# EAGLE design FullPrototypingBoard (EAGLE 7.5.0)
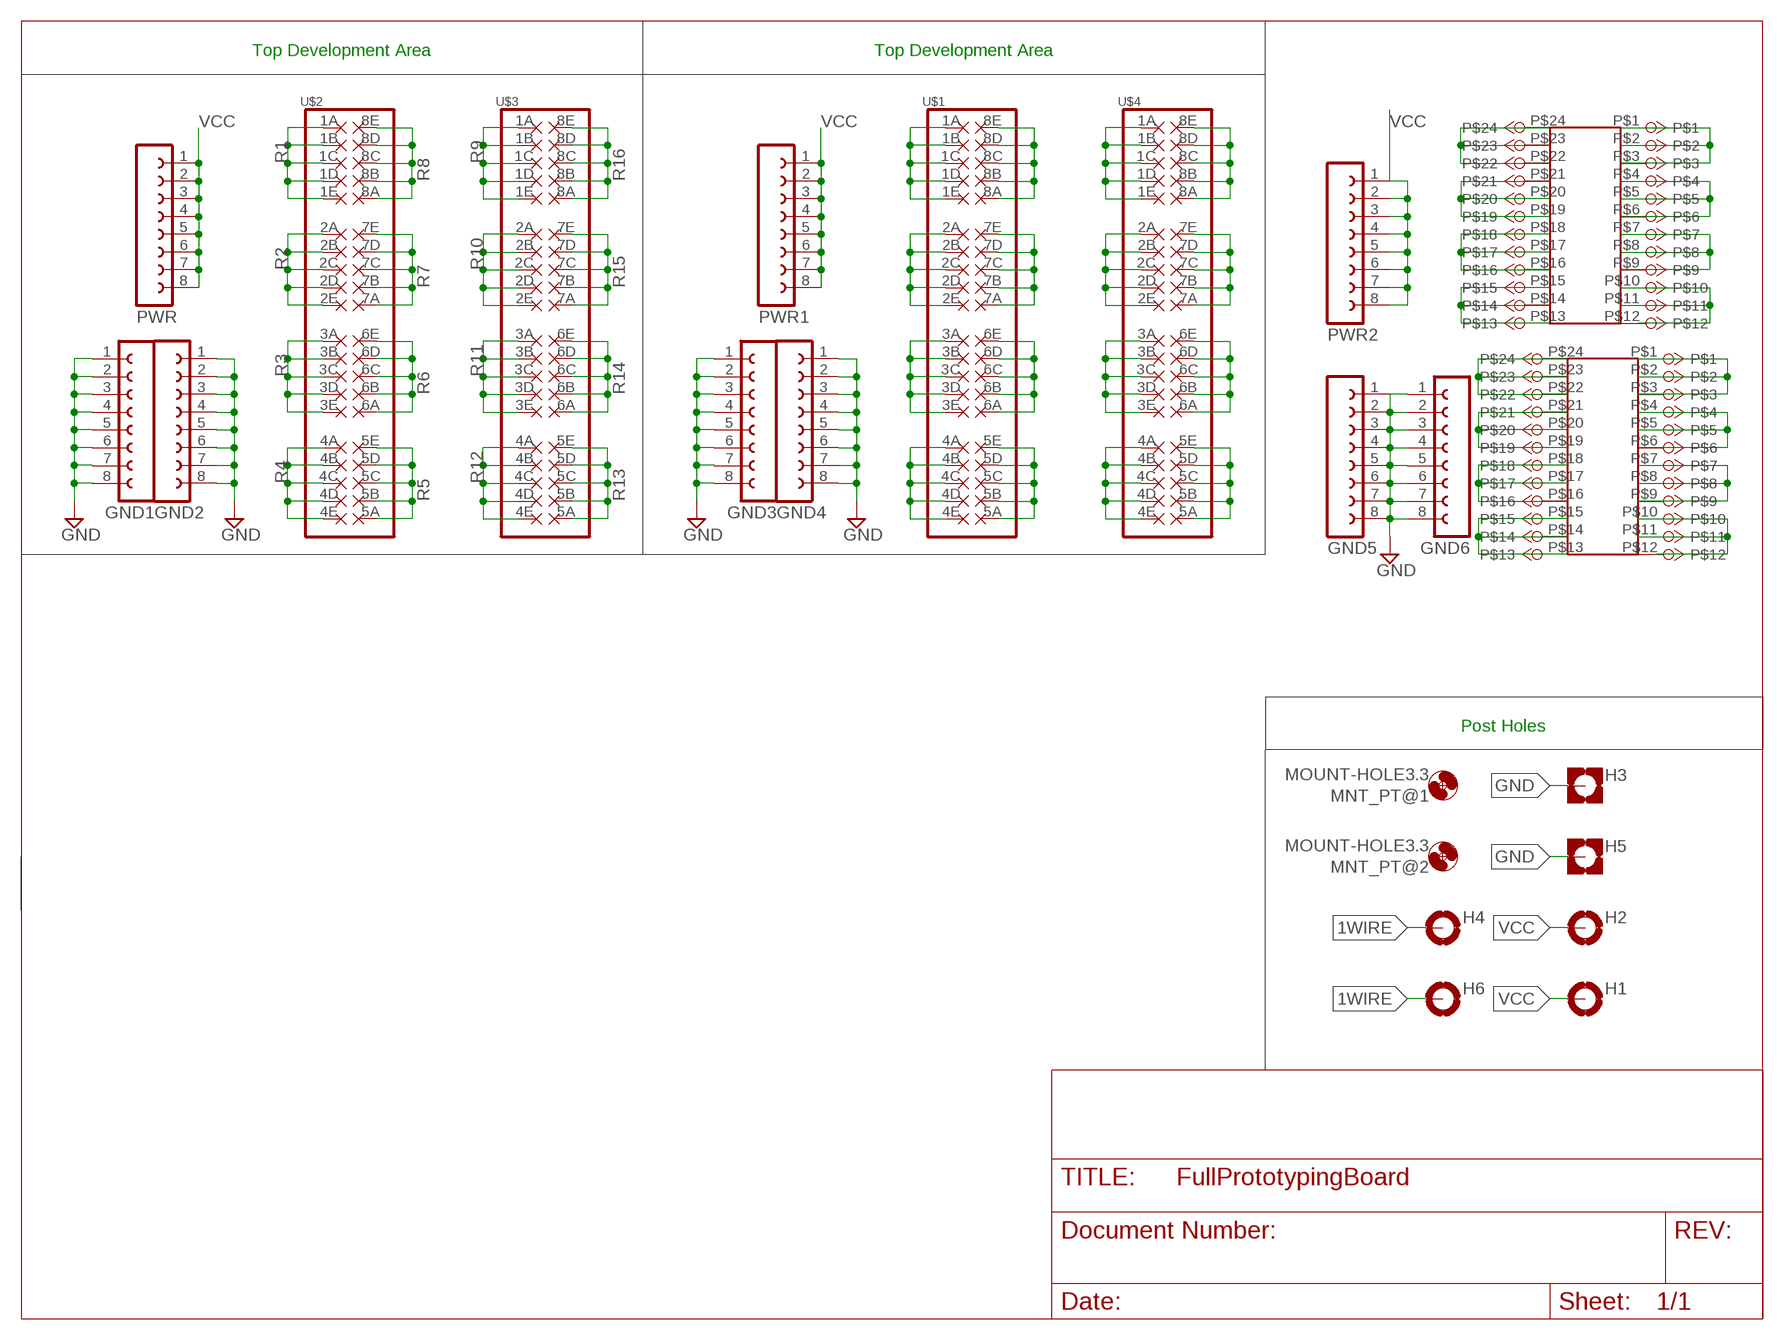
[diagram p0: schematic, sheet 1]

## Parts
GND1  FE08-1-GND  [FE08-GND]
GND2  FE08-1-GND  [FE08-GND]
GND3  FE08-1-GND  [FE08-GND]
GND4  FE08-1-GND  [FE08-GND]
GND5  FE08-1-GND  [FE08-GND]
GND6  FE08-1-GND  [FE08-GND]
H1  MOUNT-PAD-ROUND3.3  [3,3-PAD]
H2  MOUNT-PAD-ROUND3.3  [3,3-PAD]
H3  MOUNT-PAD-SQUARE3.3  [3,3-PAD-SQUARE]
H4  MOUNT-PAD-ROUND3.3  [3,3-PAD]
H5  MOUNT-PAD-SQUARE3.3  [3,3-PAD-SQUARE]
H6  MOUNT-PAD-ROUND3.3  [3,3-PAD]
MNT_PT@1  MOUNT-HOLE3.3  [3,3]
MNT_PT@2  MOUNT-HOLE3.3  [3,3]
PWR  FE08-1  [FE08]
PWR1  FE08-1  [FE08]
PWR2  FE08-1  [FE08]
U$1  PROTO-5X8  [PROTO-5X08]
U$2  PROTO-5X8  [PROTO-5X08]
U$3  PROTO-5X8  [PROTO-5X08]
U$4  PROTO-5X8  [PROTO-5X08]
U$5  PROTO-3X8  [PROTO-3X08]
U$6  PROTO-3X8  [PROTO-3X08]

## Nets
1WIRE: H4.B3,3(MOUNT) H6.B3,3(MOUNT)
GND: GND1.1 GND1.2 GND1.3 GND1.4 GND1.5 GND1.6 GND1.7 GND1.8 GND2.1 GND2.2 GND2.3 GND2.4 GND2.5 GND2.6 GND2.7 GND2.8 GND3.1 GND3.2 GND3.3 GND3.4 GND3.5 GND3.6 GND3.7 GND3.8 GND4.1 GND4.2 GND4.3 GND4.4 GND4.5 GND4.6 GND4.7 GND4.8 GND5.1 GND5.2 GND5.3 GND5.4 GND5.5 GND5.6 GND5.7 GND5.8 GND6.1 GND6.2 GND6.3 GND6.4 GND6.5 GND6.6 GND6.7 GND6.8 H3.B3,3(MOUNT) H5.B3,3(MOUNT)
N$1: U$5.P$22 U$5.P$23 U$5.P$24
N$2: U$5.P$19 U$5.P$20 U$5.P$21
N$3: U$5.P$16 U$5.P$17 U$5.P$18
N$4: U$5.P$13 U$5.P$14 U$5.P$15
N$5: U$5.P$1 U$5.P$2 U$5.P$3
N$6: U$5.P$4 U$5.P$5 U$5.P$6
N$7: U$5.P$7 U$5.P$8 U$5.P$9
N$8: U$5.P$10 U$5.P$11
N$9: U$6.P$22 U$6.P$23 U$6.P$24
N$10: U$6.P$19 U$6.P$20 U$6.P$21
N$11: U$6.P$16 U$6.P$17 U$6.P$18
N$12: U$6.P$13 U$6.P$14 U$6.P$15
N$13: U$6.P$1 U$6.P$2 U$6.P$3
N$14: U$6.P$4 U$6.P$5 U$6.P$6
N$15: U$6.P$7 U$6.P$8 U$6.P$9
N$16: U$6.P$10 U$6.P$11
N$17: U$1.1A U$1.1B U$1.1C U$1.1D U$1.1E
N$18: U$1.8A U$1.8B U$1.8C U$1.8D U$1.8E
N$19: U$1.7A U$1.7B U$1.7C U$1.7D U$1.7E
N$20: U$1.2A U$1.2B U$1.2C U$1.2D U$1.2E
N$21: U$1.6A U$1.6B U$1.6C U$1.6D U$1.6E
N$22: U$1.3A U$1.3B U$1.3C U$1.3D U$1.3E
N$23: U$1.5A U$1.5B U$1.5C U$1.5D U$1.5E
N$24: U$1.4A U$1.4B U$1.4C U$1.4D U$1.4E
N$25: U$4.8A U$4.8B U$4.8C U$4.8D U$4.8E
N$26: U$4.1A U$4.1B U$4.1C U$4.1D U$4.1E
N$27: U$4.7A U$4.7B U$4.7C U$4.7D U$4.7E
N$28: U$4.2A U$4.2B U$4.2C U$4.2D U$4.2E
N$29: U$4.6A U$4.6B U$4.6C U$4.6D U$4.6E
N$30: U$4.3A U$4.3B U$4.3C U$4.3D U$4.3E
N$31: U$4.5A U$4.5B U$4.5C U$4.5D U$4.5E
N$32: U$4.4A U$4.4B U$4.4C U$4.4D U$4.4E
R1: U$2.1A U$2.1B U$2.1C U$2.1D U$2.1E
R2: U$2.2A U$2.2B U$2.2C U$2.2D U$2.2E
R3: U$2.3A U$2.3B U$2.3C U$2.3D U$2.3E
R4: U$2.4A U$2.4B U$2.4C U$2.4D U$2.4E
R5: U$2.5A U$2.5B U$2.5C U$2.5D U$2.5E
R6: U$2.6A U$2.6B U$2.6C U$2.6D U$2.6E
R7: U$2.7A U$2.7B U$2.7C U$2.7D U$2.7E
R8: U$2.8A U$2.8B U$2.8C U$2.8D U$2.8E
R9: U$3.1A U$3.1B U$3.1C U$3.1D U$3.1E
R10: U$3.2A U$3.2B U$3.2C U$3.2D U$3.2E
R11: U$3.3A U$3.3B U$3.3C U$3.3D U$3.3E
R12: U$3.4A U$3.4B U$3.4C U$3.4D U$3.4E
R13: U$3.5A U$3.5B U$3.5C U$3.5D U$3.5E
R14: U$3.6A U$3.6B U$3.6C U$3.6D U$3.6E
R15: U$3.7A U$3.7B U$3.7C U$3.7D U$3.7E
R16: U$3.8A U$3.8B U$3.8C U$3.8D U$3.8E
VCC: H1.B3,3(MOUNT) H2.B3,3(MOUNT) PWR1.1 PWR1.2 PWR1.3 PWR1.4 PWR1.5 PWR1.6 PWR1.7 PWR1.8 PWR2.1 PWR2.2 PWR2.3 PWR2.4 PWR2.5 PWR2.6 PWR2.7 PWR2.8 PWR.1 PWR.2 PWR.3 PWR.4 PWR.5 PWR.6 PWR.7 PWR.8
Unconnected: U$5.P$12 U$6.P$12

## Notes on the sheet
- Top Development Area | Top Development Area
- Post Holes

## Library data of the parts
GND1-GND6 = prototyping_holes:FE08-1-GND: FEMALE HEADER; OC_FARNELL: unknown; OC_NEWARK: unknown
H1 H2 H4 H6 = holes:MOUNT-PAD-ROUND: MOUNTING PAD, round
H3 H5 = holes:MOUNT-PAD-SQUARE: MOUNTING PAD, square
MNT_PT@1 MNT_PT@2 = holes:MOUNT-HOLE: MOUNTING HOLE with drill center marker
PWR PWR1 PWR2 = con-lsta:FE08-1: FEMALE HEADER; OC_FARNELL: unknown; OC_NEWARK: unknown
U$1-U$4 = prototyping_holes:PROTO-5X8
U$5 U$6 = prototyping_holes:PROTO-3X8

## Board
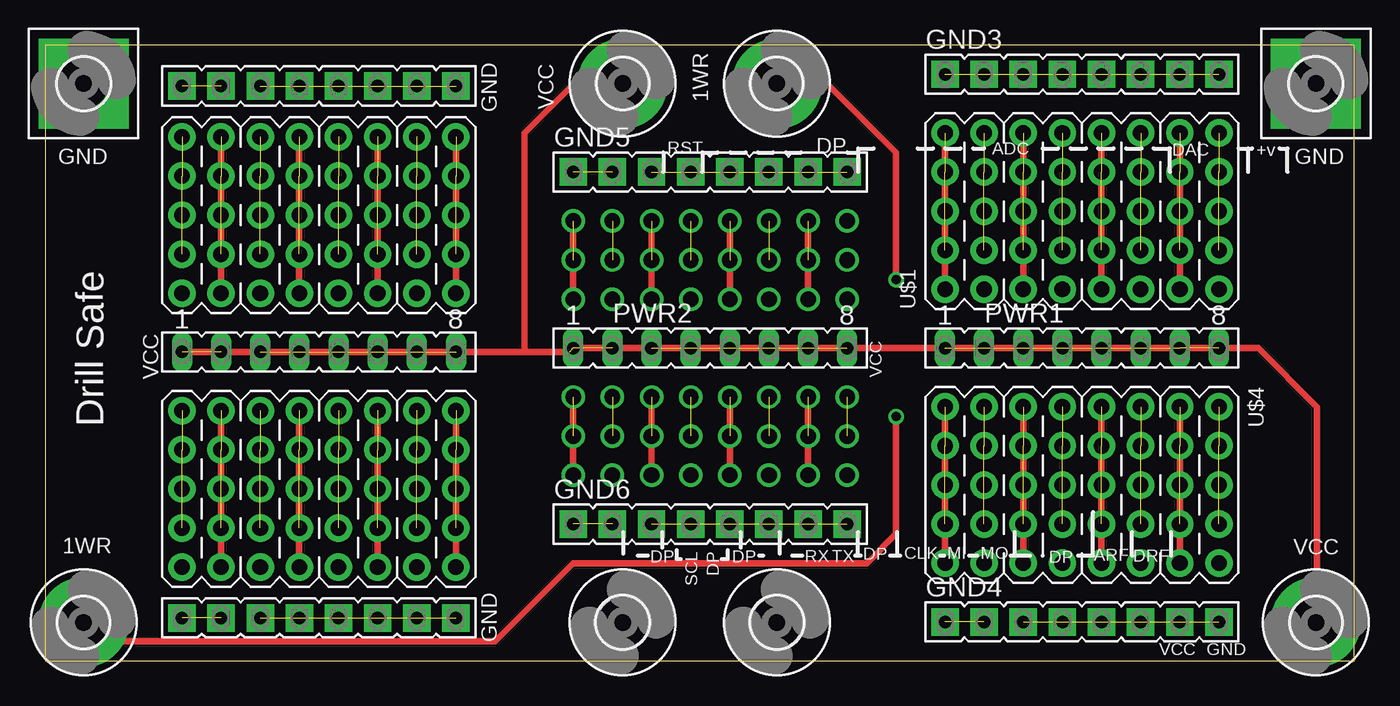
[diagram p1: board, top side]
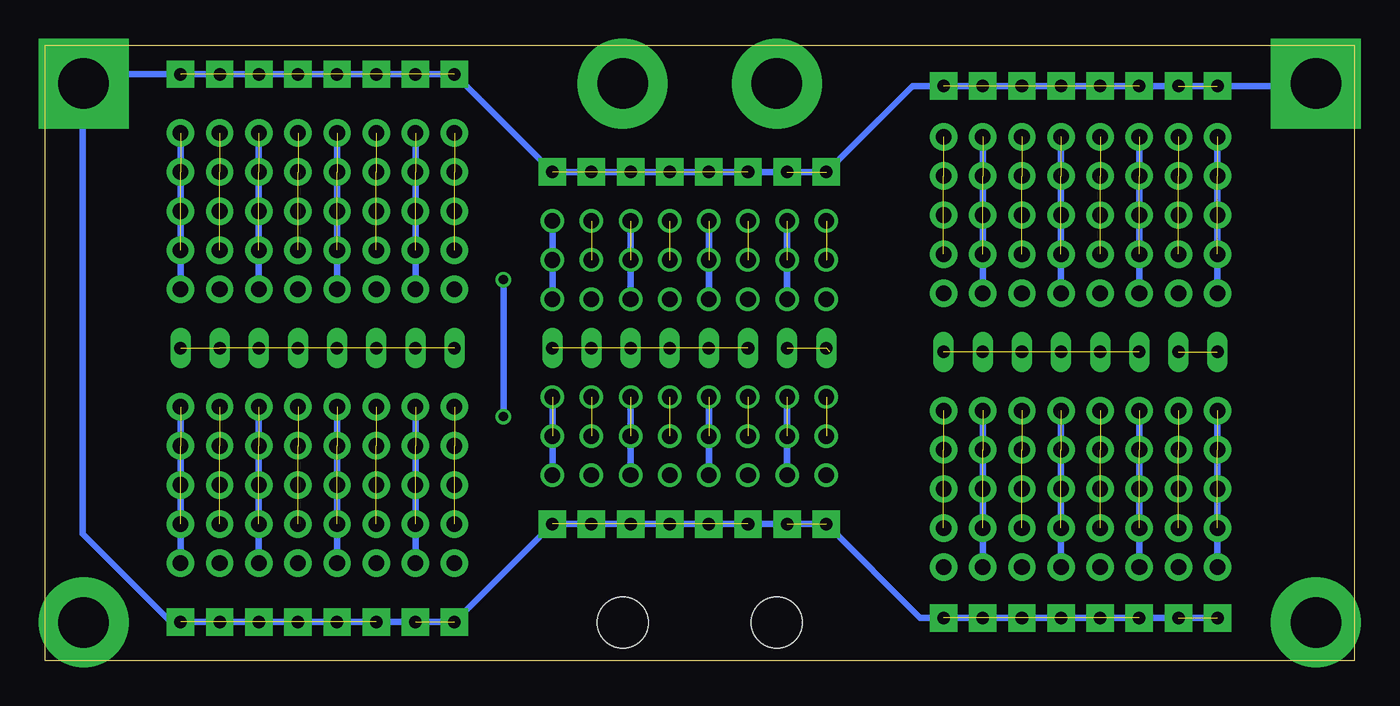
[diagram p2: board, bottom side, seen from below]

Size 85 x 40 mm. Coordinates in mm from the lower left corner, seen from the top.
Outline: 0,0 85,0 85,40 0,40 0,0
Copper layers (1*16): Top 0.035mm / dielectric 1.5mm / Bottom 0.035mm
Design rules "default *": minimum track width 10mil, minimum drill 19mil, track to track 8mil, track to pad 8mil, pad to pad 8mil, via to via 8mil, smd to smd 8mil, copper to edge 40mil, drill to drill 8mil, minimum pad ring 10mil, minimum via ring 8mil, stop-mask expansion 4mil, vias tented up to drill 0mil, thermal gap 10mil

### Footprints (pad centres in the part's own frame; a part is rotated, then mirrored left to right if it is on the bottom)
FE08-GND = drill 0.813 pad 1.778 square: 1 -8.89,0; 2 -6.35,0; 3 -3.81,0; 4 -1.27,0; 5 1.27,0; 6 3.81,0; 7 6.35,0; 8 8.89,0
3,3-PAD = drill 3.3 pad 5.842: B3,3 0,0
3,3-PAD-SQUARE = drill 3.3 pad 5.842 square: B3,3 0,0
3,3 = hole 3.3: 0,0
FE08 = drill 0.813 long: 1 -8.89,0; 2 -6.35,0; 3 -3.81,0; 4 -1.27,0; 5 1.27,0; 6 3.81,0; 7 6.35,0; 8 8.89,0
PROTO-5X08 = drill 1.016 pad 1.778: 1A -5.08,8.89; 1B -2.54,8.89; 1C 0,8.89; 1D 2.54,8.89; 1E 5.08,8.89; 2A -5.08,6.35; 2B -2.54,6.35; 2C 0,6.35; 2D 2.54,6.35; 2E 5.08,6.35; 3A -5.08,3.81; 3B -2.54,3.81; 3C 0,3.81; 3D 2.54,3.81; 3E 5.08,3.81; 4A -5.08,1.27; 4B -2.54,1.27; 4C 0,1.27; 4D 2.54,1.27; 4E 5.08,1.27; 5A -5.08,-1.27; 5B -2.54,-1.27; 5C 0,-1.27; 5D 2.54,-1.27; 5E 5.08,-1.27; 6A -5.08,-3.81; 6B -2.54,-3.81; 6C 0,-3.81; 6D 2.54,-3.81; 6E 5.08,-3.81; 7A -5.08,-6.35; 7B -2.54,-6.35; 7C 0,-6.35; 7D 2.54,-6.35; 7E 5.08,-6.35; 8A -5.08,-8.89; 8B -2.54,-8.89; 8C 0,-8.89; 8D 2.54,-8.89; 8E 5.08,-8.89
PROTO-3X08 = drill 1.016: P$1 0,0; P$2 0,-2.54; P$3 0,-5.08; P$4 2.54,0; P$5 2.54,-2.54; P$6 2.54,-5.08; P$7 5.08,0; P$8 5.08,-2.54; P$9 5.08,-5.08; P$10 7.62,0; P$11 7.62,-2.54; P$12 7.62,-5.08; P$13 10.16,0; P$14 10.16,-2.54; P$15 10.16,-5.08; P$16 12.7,0; P$17 12.7,-2.54; P$18 12.7,-5.08; P$19 15.24,0; P$20 15.24,-2.54; P$21 15.24,-5.08; P$22 17.78,0; P$23 17.78,-2.54; P$24 17.78,-5.08

### Placement (x,y rotation side)
GND1  17.78,37.34 0 top
GND2  17.78,2.79 0 top
GND3  67.31,38.1 0 top
GND4  67.31,2.54 0 top
GND5  43.18,31.75 0 top
GND6  43.18,8.89 0 top
H1  82.5,2.5 0 top
H2  37.5,37.5 0 top
H3  82.5,37.5 0 top
H4  47.5,37.5 0 top
H5  2.5,37.5 0 top
H6  2.5,2.5 0 top
MNT_PT@1  47.5,2.5 0 top
MNT_PT@2  37.5,2.5 0 top
PWR  17.78,20.07 0 top
PWR1  67.31,20.32 0 top
PWR2  43.18,20.32 0 top
U$1  67.31,29.21 90 top
U$2  17.78,28.96 270 top
U$3  17.78,11.18 270 top
U$4  67.31,11.43 270 top
U$5  34.29,28.57 0 top
U$6  34.29,17.14 0 top

### Tracks (layer width: path | path; a pad name or v marks a point on that pad's centre or on a via)
1WIRE  (via drill 0.6)
  Top 0.406: H4.B3,3 50.77,37.5 55.24,33.02 v55.24,24.77 | v55.24,15.88 55.24,8.26 53.34,6.35 34.29,6.35 29.21,1.27 3.73,1.27 H6.B3,3
  Bottom 0.406: v55.24,24.77 v55.24,15.88
GND  (37 unrouted)
  Bottom 0.406: H5.B3,3 2.66,37.34 GND1.1 GND1.8 28.7,37.34 GND5.1 GND5.8 GND3.1 81.9,38.1 H3.B3,3 82.55,37.45 82.55,8.26 76.83,2.54 GND4.8 GND4.1 GND6.8 GND6.1 28.19,2.79 GND2.8 GND2.1
N$1
  Bottom 0.406: U$5.P$22 U$5.P$23 U$5.P$24
N$2  (1 unrouted)
  Top 0.406: U$5.P$21 U$5.P$19
N$3  (1 unrouted)
  Bottom 0.406: U$5.P$16 U$5.P$18
N$4  (1 unrouted)
  Top 0.406: U$5.P$15 U$5.P$13
N$5  (1 unrouted)
  Top 0.406: U$5.P$3 U$5.P$1
N$6  (1 unrouted)
  Bottom 0.406: U$5.P$4 U$5.P$6
N$7  (1 unrouted)
  Top 0.406: U$5.P$9 U$5.P$7
N$8  (1 unrouted)
  Bottom 0.406: U$5.P$10 41.91,23.5
N$9  (1 unrouted)
  Bottom 0.406: U$6.P$22 U$6.P$24
N$10  (1 unrouted)
  Top 0.406: U$6.P$19 U$6.P$21
N$11  (1 unrouted)
  Bottom 0.406: U$6.P$16 U$6.P$18
N$12  (1 unrouted)
  Top 0.406: U$6.P$13 U$6.P$15
N$13  (1 unrouted)
  Top 0.406: U$6.P$1 U$6.P$3
N$14  (1 unrouted)
  Bottom 0.406: U$6.P$6 U$6.P$4
N$15  (1 unrouted)
  Top 0.406: U$6.P$7 U$6.P$9
N$16  (1 unrouted)
  Bottom 0.406: U$6.P$10 41.91,12.06
N$17  (3 unrouted)
  Top 0.406: U$1.1A U$1.1E
N$18  (3 unrouted)
  Bottom 0.406: U$1.8E U$1.8A
N$19  (3 unrouted)
  Top 0.406: U$1.7A U$1.7E
N$20  (3 unrouted)
  Bottom 0.406: U$1.2E U$1.2A
N$21  (3 unrouted)
  Bottom 0.406: U$1.6A U$1.6E
N$22  (3 unrouted)
  Top 0.406: U$1.3A U$1.3E
N$23  (3 unrouted)
  Top 0.406: U$1.5A U$1.5E
N$24  (3 unrouted)
  Bottom 0.406: U$1.4E U$1.4A
N$25  (3 unrouted)
  Top 0.406: U$4.8E U$4.8A
N$26  (3 unrouted)
  Bottom 0.406: U$4.1A U$4.1E
N$27  (3 unrouted)
  Bottom 0.406: U$4.7A U$4.7E
N$28  (3 unrouted)
  Top 0.406: U$4.2E U$4.2A
N$29  (3 unrouted)
  Top 0.406: U$4.6E U$4.6A
N$30  (3 unrouted)
  Bottom 0.406: U$4.3A U$4.3E
N$31  (3 unrouted)
  Bottom 0.406: U$4.5A U$4.5E
N$32  (3 unrouted)
  Top 0.406: U$4.4E U$4.4A
R1  (3 unrouted)
  Top 0.406: U$2.1A U$2.1E
R2  (3 unrouted)
  Bottom 0.406: U$2.2E U$2.2A
R3  (3 unrouted)
  Top 0.406: U$2.3A U$2.3E
R4  (3 unrouted)
  Bottom 0.406: U$2.4E U$2.4A
R5  (3 unrouted)
  Top 0.406: U$2.5A U$2.5E
R6  (3 unrouted)
  Bottom 0.406: U$2.6E U$2.6A
R7  (3 unrouted)
  Top 0.406: U$2.7A U$2.7E
R8  (3 unrouted)
  Bottom 0.406: U$2.8E U$2.8A
R9  (3 unrouted)
  Top 0.406: U$3.1E U$3.1A
R10  (3 unrouted)
  Bottom 0.406: U$3.2E U$3.2A
R11  (3 unrouted)
  Top 0.406: U$3.3E U$3.3A
R12  (3 unrouted)
  Bottom 0.406: U$3.4E U$3.4A
R13  (3 unrouted)
  Top 0.406: U$3.5E U$3.5A
R14  (3 unrouted)
  Bottom 0.406: U$3.6E U$3.6A
R15  (3 unrouted)
  Top 0.406: U$3.7E U$3.7A
R16  (3 unrouted)
  Bottom 0.406: U$3.8E U$3.8A
VCC  (20 unrouted)
  Top 0.406: 31.11,20.07 PWR.8 PWR.1 | 31.11,20.07 34.04,20.07 | PWR2.1 PWR2.8 PWR1.8 78.74,20.32 82.55,16.51 82.55,2.55 H1.B3,3 | H2.B3,3 34.33,37.5 31.11,34.29 31.11,20.07

### Text on the board
tPlace: RST | DP | ADC | DAC | +v | SCL | DP | DP | CLK | MI | MO | ARF | DP | DP | RX | TX | DP | DRF
tNames: GND | VCC | 1WR | GND | GND | VCC | VCC | Drill Safe | 1WR | VCC | GND | VCC | GND